# EasyEDA schematic 1-Schematic_Raspberry Pi2.json
TITLE: Gateway; REV: 1.0; Date: 2023-08-24; Sheet: 1/1; Drawn By: Kricharitch; Company: LoRaRice_gateway
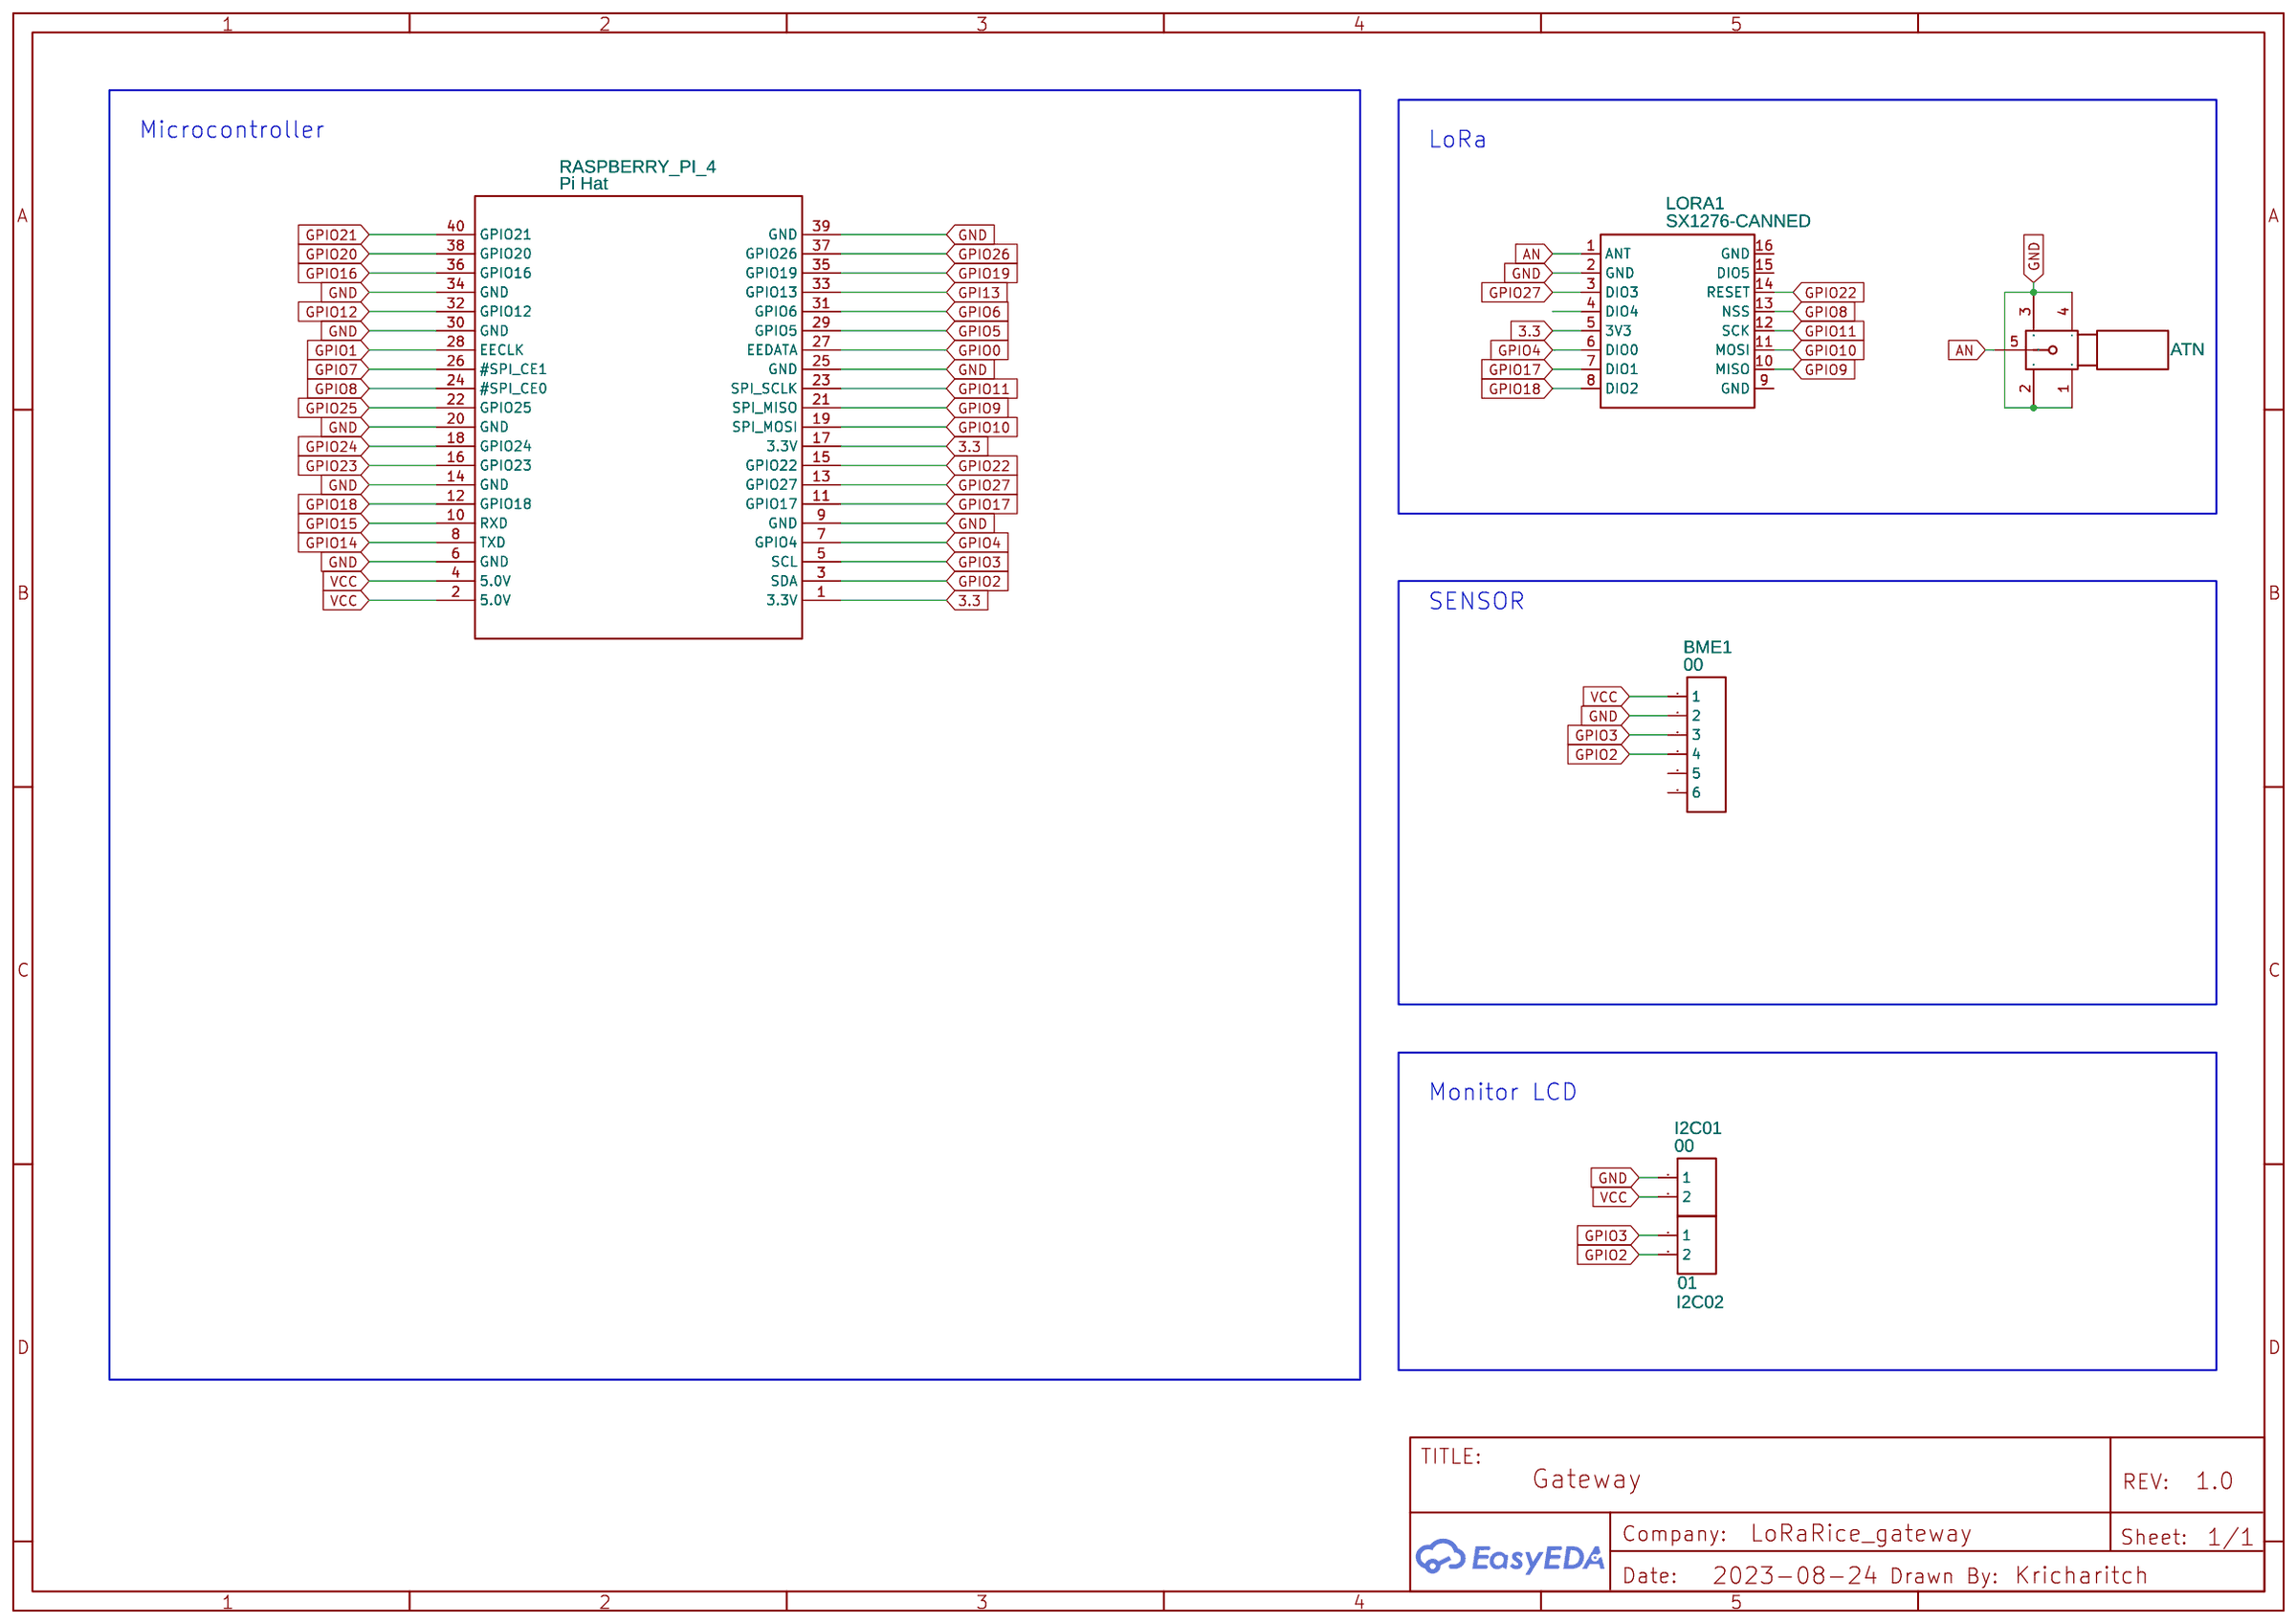
[diagram p0: schematic sheet]

## Parts
BME1  00  [HDR-F-2.54_1X6]
I2C01  00  [CONN-TH_2P-P5.00]
I2C02  01  [CONN-TH_2P-P5.00]
LORA1  SX1276-CANNED  [SX1276-CANNED]
RASPBERRY_PI_4  Pi Hat  [PITFT 2.2]
RF1  ATN  [SMA-SMD_BWSMA-KE-P001]

## Library data of the parts
BME1 = HDR-F-2.54_1x6: Supplier Part: C40877; Supplier: LCSC; Contributor: LCEDA_Lib
I2C01 I2C02 = CONN-TH_2P-P5.00: Supplier: LCSC; Contributor: LCEDA_Lib
LORA1 = SX1276-CANNED: Manufacturer: G-NiceRF; Manufacturer Part: LoRa1276-C1; Supplier: Banggood; Supplier Part: Unknown; link: https://uk.banggood.com/LoRa1276-C1-SX1276-868MHz-LoRa-Module-Remote-Spread-Spectrum-Wireless-Module-20dBm-100mW-3-5KM-p-1416393.html?gmcCountry=GB¤cy=GBP&createTmp=1&utm_source=googleshopping&utm_medium=cpc_bgcs&utm_content=garman&utm_campaign=pla-gbg-ele-pc&gclid=EAIaIQobChMIouzku5XS4gIVipTtCh1cvgo9EAYYByABEgJIPfD_BwE&cur_warehouse=CN; Contributor: P-Thomsen
RASPBERRY_PI_4 = -: sourceId: vnhasKEWe; subpart_no: 1
RF1 = BWSMA-KE-P001: Contributor: LCSC; Supplier: LCSC; Supplier Part: C496550; Manufacturer: BAT WIRELESS(蝙蝠无线); JLCPCB Part Class: Extended Part

## Nets
GND: BME1.2 I2C01.1 LORA1.2(GND) RASPBERRY_PI_4.6(GND) RASPBERRY_PI_4.9(GND) RASPBERRY_PI_4.14(GND) RASPBERRY_PI_4.20(GND) RASPBERRY_PI_4.25(GND) RASPBERRY_PI_4.30(GND) RASPBERRY_PI_4.34(GND) RASPBERRY_PI_4.39(GND) RF1.1 RF1.2 RF1.3 RF1.4
VCC: BME1.1 I2C01.2 RASPBERRY_PI_4.2(5.0V) RASPBERRY_PI_4.4(5.0V)
3.3: LORA1.5(3V3) RASPBERRY_PI_4.1(3.3V) RASPBERRY_PI_4.17(3.3V)
AN: LORA1.1(ANT) RF1.5
GPI13: RASPBERRY_PI_4.33(GPIO13)
GPIO0: RASPBERRY_PI_4.27(EEDATA)
GPIO1: RASPBERRY_PI_4.28(EECLK)
GPIO2: BME1.4 I2C02.2 RASPBERRY_PI_4.3(SDA)
GPIO3: BME1.3 I2C02.1 RASPBERRY_PI_4.5(SCL)
GPIO4: LORA1.6(DIO0) RASPBERRY_PI_4.7(GPIO4)
GPIO5: RASPBERRY_PI_4.29(GPIO5)
GPIO6: RASPBERRY_PI_4.31(GPIO6)
GPIO7: RASPBERRY_PI_4.26(#SPI_CE1)
GPIO8: LORA1.13(NSS) RASPBERRY_PI_4.24(#SPI_CE0)
GPIO9: LORA1.10(MISO) RASPBERRY_PI_4.21(SPI_MISO)
GPIO10: LORA1.11(MOSI) RASPBERRY_PI_4.19(SPI_MOSI)
GPIO11: LORA1.12(SCK) RASPBERRY_PI_4.23(SPI_SCLK)
GPIO12: RASPBERRY_PI_4.32(GPIO12)
GPIO14: RASPBERRY_PI_4.8(TXD)
GPIO15: RASPBERRY_PI_4.10(RXD)
GPIO16: RASPBERRY_PI_4.36(GPIO16)
GPIO17: LORA1.7(DIO1) RASPBERRY_PI_4.11(GPIO17)
GPIO18: LORA1.8(DIO2) RASPBERRY_PI_4.12(GPIO18)
GPIO19: RASPBERRY_PI_4.35(GPIO19)
GPIO20: RASPBERRY_PI_4.38(GPIO20)
GPIO21: RASPBERRY_PI_4.40(GPIO21)
GPIO22: LORA1.14(RESET) RASPBERRY_PI_4.15(GPIO22)
GPIO23: RASPBERRY_PI_4.16(GPIO23)
GPIO24: RASPBERRY_PI_4.18(GPIO24)
GPIO25: RASPBERRY_PI_4.22(GPIO25)
GPIO26: RASPBERRY_PI_4.37(GPIO26)
GPIO27: LORA1.3(DIO3) RASPBERRY_PI_4.13(GPIO27)

Not connected (* = marked no-connect by the designer): BME1 5 6; LORA1 4(DIO4) 9(GND) 15(DIO5) 16(GND)

## Notes on the sheet
- Microcontroller
- LoRa
- SENSOR
- Monitor LCD
